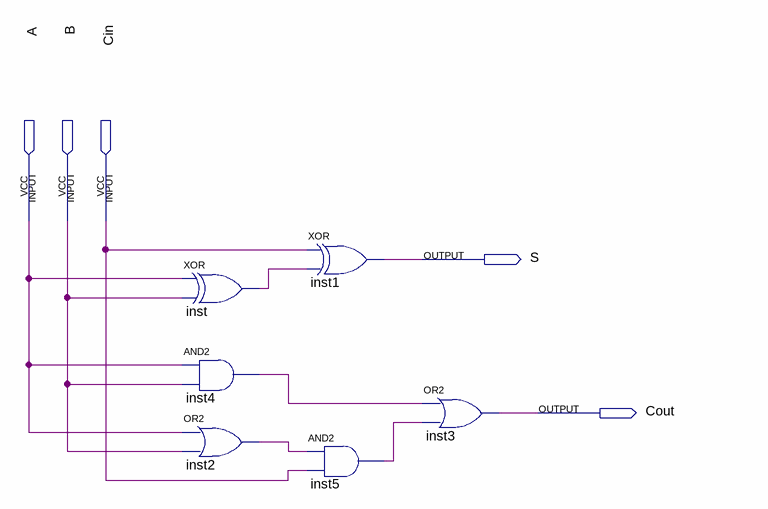
[diagram p0: schematic sheet]
// Quartus schematic proj-6-somador-completo.bdf as structural Verilog: 6 symbols, 5 pins
module \proj-6-somador-completo  (
  input  A,
  input  B,
  input  Cin,
  output S,
  output Cout
);

  wire inst2_out, inst4_out, inst5_out, inst_out;

  xor inst (inst_out, A, B);
  and inst4 (inst4_out, A, B);
  or inst2 (inst2_out, A, B);
  xor inst1 (S, Cin, inst_out);
  and inst5 (inst5_out, inst2_out, Cin);
  or inst3 (Cout, inst4_out, inst5_out);
endmodule
